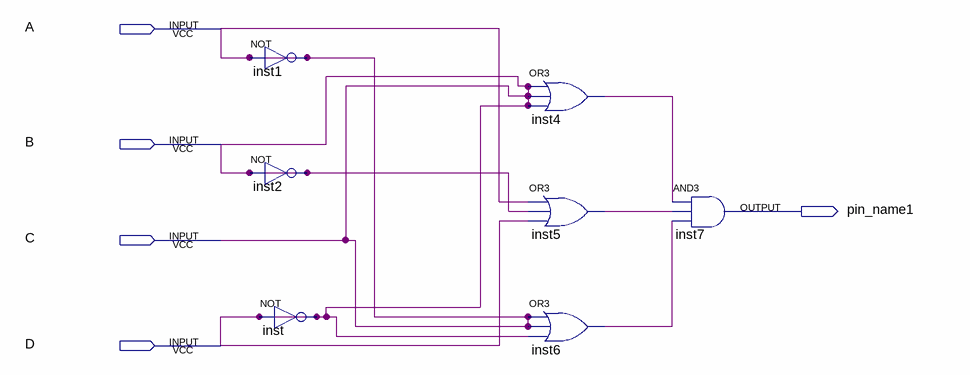
[diagram p0: schematic sheet]
// Quartus schematic Project1.bdf as structural Verilog: 7 symbols, 5 pins
module Project1 (
  input  A,
  input  B,
  input  C,
  input  D,
  output pin_name1
);

  wire inst4_out, inst5_out, inst6_out;

  not inst1 (A, A);
  not inst2 (A, A);
  not inst (A, A);
  or inst4 (inst4_out, A, A, A);
  or inst5 (inst5_out, A, A, A);
  or inst6 (inst6_out, A, A, A);
  // AND3 inst7 has open pins: IN1=inst4_out, IN2=inst5_out, IN3=inst6_out, OUT=open

  assign B = A;
  assign C = A;
  assign D = A;
endmodule
